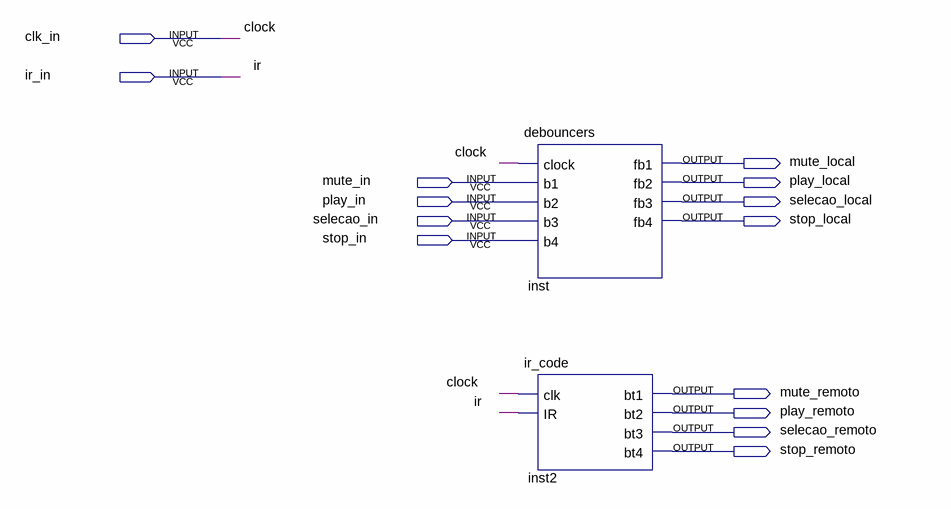
[diagram p0: schematic sheet]
// Quartus schematic Bloco_Tratamento_Dados.bdf as structural Verilog: 2 symbols, 14 pins
module Bloco_Tratamento_Dados (
  input  clk_in,
  input  ir_in,
  input  mute_in,
  input  play_in,
  input  selecao_in,
  input  stop_in,
  output mute_local,
  output play_local,
  output selecao_local,
  output stop_local,
  output mute_remoto,
  output play_remoto,
  output selecao_remoto,
  output stop_remoto
);

  debouncers inst (
    .clock(clk_in), .b1(mute_in), .b2(play_in), .b3(selecao_in), .b4(stop_in), .fb1(mute_local),
    .fb2(play_local), .fb3(selecao_local), .fb4(stop_local));
  ir_code inst2 (
    .clk(clk_in), .IR(ir_in), .bt1(mute_remoto), .bt2(play_remoto), .bt3(selecao_remoto), .bt4(stop_remoto));

  // Other names for the same wires on the sheet: clock = clk_in; ir = ir_in
endmodule
